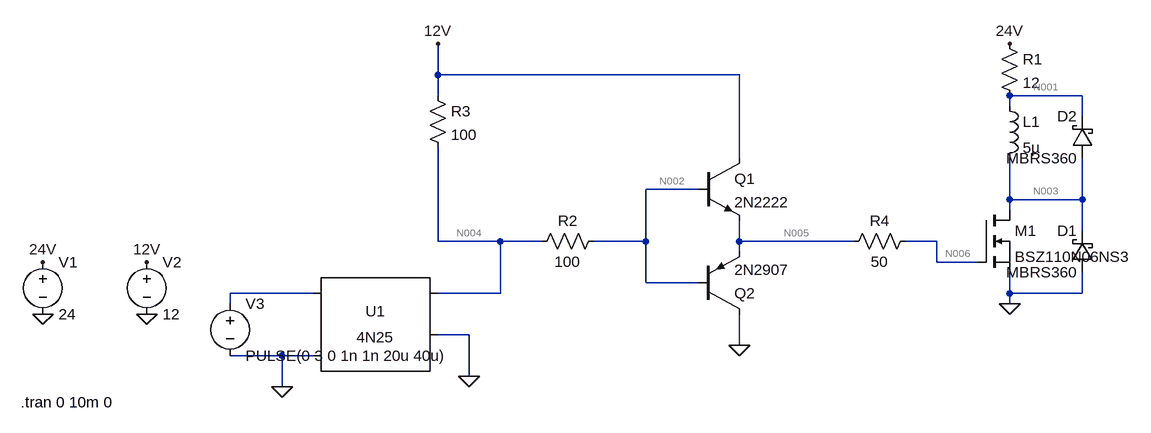
[diagram p0: schematic 20210907_solenoid_driver_draft.asc]
20210907_solenoid_driver_draft.asc, the LTspice schematic file:
Version 4
SHEET 1 2472 680
WIRE 976 -336 976 -384
WIRE 1440 -336 976 -336
WIRE 976 -304 976 -336
WIRE 1968 -304 1856 -304
WIRE 1856 -288 1856 -304
WIRE 1968 -272 1968 -304
WIRE 1440 -208 1440 -336
WIRE 1376 -160 1296 -160
WIRE 1856 -144 1856 -208
WIRE 1968 -144 1968 -208
WIRE 1968 -144 1856 -144
WIRE 1856 -128 1856 -144
WIRE 1968 -96 1968 -144
WIRE 976 -80 976 -224
WIRE 1072 -80 976 -80
WIRE 1136 -80 1072 -80
WIRE 1296 -80 1296 -160
WIRE 1296 -80 1216 -80
WIRE 1440 -80 1440 -112
WIRE 1616 -80 1440 -80
WIRE 1744 -80 1696 -80
WIRE 1440 -64 1440 -80
WIRE 1744 -48 1744 -80
WIRE 1808 -48 1744 -48
WIRE 1296 -16 1296 -80
WIRE 1376 -16 1296 -16
WIRE 784 0 656 0
WIRE 1072 0 1072 -80
WIRE 1072 0 976 0
WIRE 1856 0 1856 -32
WIRE 1968 0 1968 -32
WIRE 1968 0 1856 0
WIRE 656 16 656 0
WIRE 1856 16 1856 0
WIRE 1024 64 976 64
WIRE 1440 80 1440 32
WIRE 736 96 656 96
WIRE 784 96 736 96
WIRE 1024 128 1024 64
WIRE 736 144 736 96
FLAG 368 32 0
FLAG 368 -48 24V
FLAG 528 32 0
FLAG 528 -48 12V
FLAG 1856 16 0
FLAG 1856 -384 24V
FLAG 1440 80 0
FLAG 976 -384 12V
FLAG 1024 128 0
FLAG 736 144 0
SYMBOL voltage 368 -64 R0
WINDOW 123 0 0 Left 0
WINDOW 39 0 0 Left 0
SYMATTR InstName V1
SYMATTR Value 24
SYMBOL voltage 528 -64 R0
WINDOW 123 0 0 Left 0
WINDOW 39 0 0 Left 0
SYMATTR InstName V2
SYMATTR Value 12
SYMBOL nmos 1808 -128 R0
SYMATTR InstName M1
SYMATTR Value BSZ110N06NS3
SYMBOL res 1840 -400 R0
SYMATTR InstName R1
SYMATTR Value 12
SYMBOL ind 1840 -304 R0
SYMATTR InstName L1
SYMATTR Value 5µ
SYMBOL npn 1376 -208 R0
SYMATTR InstName Q1
SYMATTR Value 2N2222
SYMBOL pnp 1376 32 M180
SYMATTR InstName Q2
SYMATTR Value 2N2907
SYMBOL res 1232 -96 R90
WINDOW 0 0 56 VBottom 2
WINDOW 3 32 56 VTop 2
SYMATTR InstName R2
SYMATTR Value 100
SYMBOL res 960 -320 R0
SYMATTR InstName R3
SYMATTR Value 100
SYMBOL Optos\\4N25 880 64 R0
SYMATTR InstName U1
SYMBOL res 1712 -96 R90
WINDOW 0 0 56 VBottom 2
WINDOW 3 32 56 VTop 2
SYMATTR InstName R4
SYMATTR Value 50
SYMBOL voltage 656 0 R0
WINDOW 123 0 0 Left 0
WINDOW 39 0 0 Left 0
SYMATTR InstName V3
SYMATTR Value PULSE(0 3 0 1n 1n 20u 40u)
SYMBOL schottky 1984 -32 R180
WINDOW 0 24 64 Left 2
WINDOW 3 24 0 Left 2
SYMATTR InstName D1
SYMATTR Value MBRS360
SYMATTR Description Diode
SYMATTR Type diode
SYMBOL schottky 1984 -208 R180
WINDOW 0 24 64 Left 2
WINDOW 3 24 0 Left 2
SYMATTR InstName D2
SYMATTR Value MBRS360
SYMATTR Description Diode
SYMATTR Type diode
TEXT 334 168 Left 2 !.tran 0 10m 0

The netlist it stands for:
* 20210907_solenoid_driver_draft.asc
V1 24V 0 24
V2 12V 0 12
M1 N003 N006 0 0 BSZ110N06NS3
R1 24V N001 12
L1 N001 N003 5µ
Q1 12V N002 N005 0 2N2222
Q2 0 N002 N005 0 2N2907
R2 N002 N004 100
R3 12V N004 100
XU1 N007 0 N004 0 NC_01 4N25
R4 N006 N005 50
V3 N007 0 PULSE(0 3 0 1n 1n 20u 40u)
D1 0 N003 MBRS360
D2 N003 N001 MBRS360
.model D D
.lib standard.dio
.model NPN NPN
.model PNP PNP
.lib standard.bjt
.model NMOS NMOS
.model PMOS PMOS
.lib standard.mos
.tran 0 10m 0
.lib 4N25.sub
.backanno
.end

* Results of the author's LTspice run, read from the files saved beside the schematic
* Operating Point, zero values left out:
*   V(24v) = 24 V
*   V(12v) = 12 V
*   V(n003) = 16.2 mV
*   V(n006) = 12 V
*   V(n001) = 18.2 mV
*   V(n002) = 12 V
*   V(n005) = 12 V
*   V(n004) = 12 V
*   Ic(Q2) = -12.01 pA
*   Ib(Q2) = 12.01 pA
*   Id(M1) = 1.998 A
*   Is(M1) = -1.998 A
*   I(D2) = -1.541 µA
*   I(D1) = -9.85 µA
*   I(L1) = 1.998 A
*   I(R3) = 162.1 pA
*   I(R2) = -12.01 pA
*   I(R1) = 1.998 A
*   I(V2) = -162.1 pA
*   I(V1) = -1.998 A
*   Ix(u1:3) = 150.1 pA
*   Ix(u1:4) = -150.1 pA